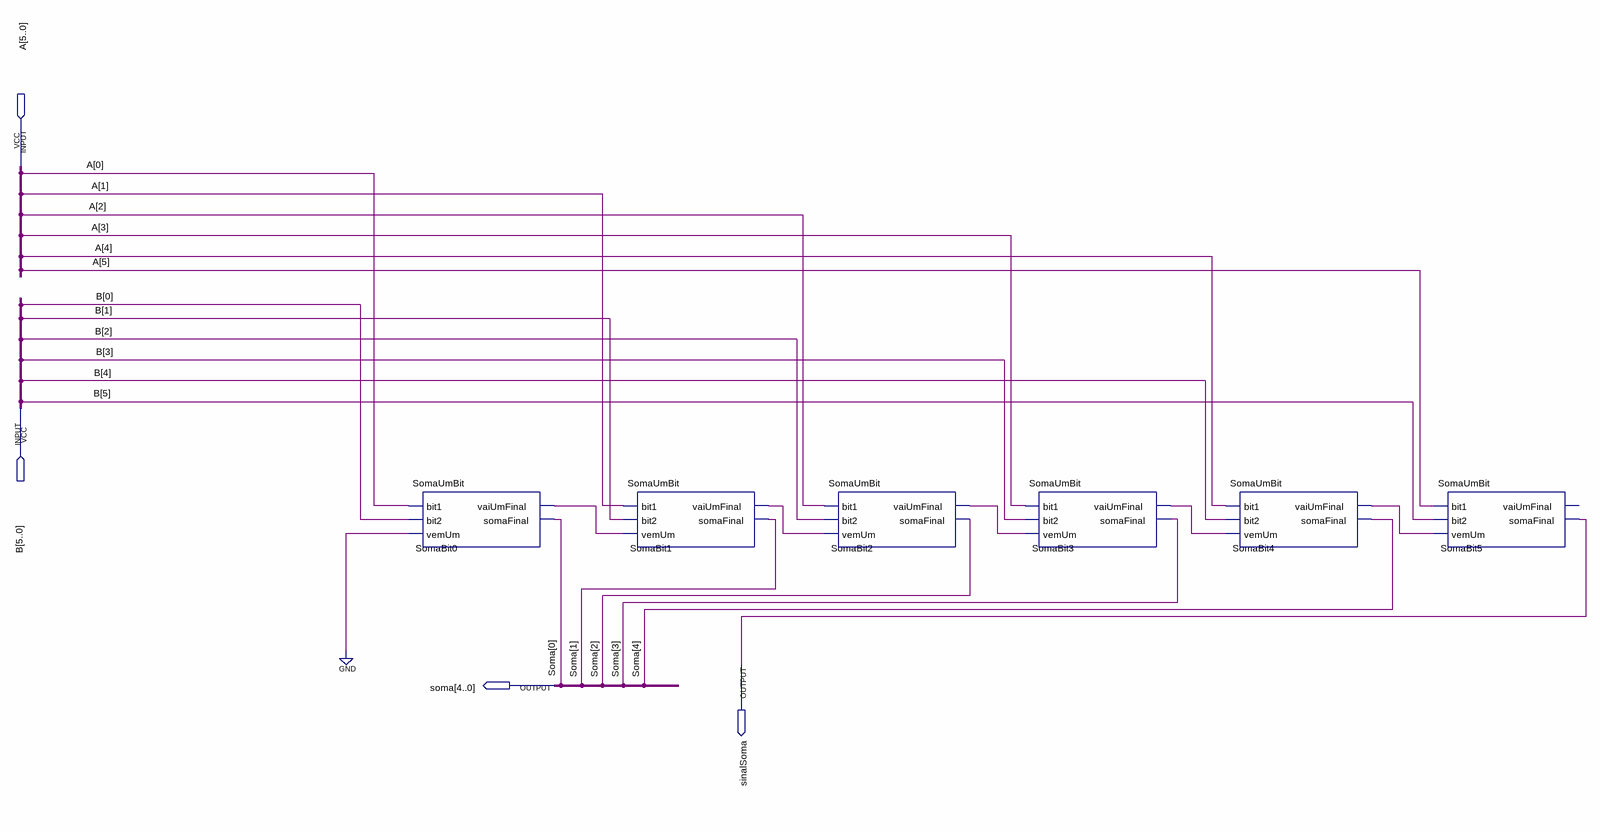
[diagram p0: schematic sheet]
// Quartus schematic SomaBitsComSinalComp.bdf as structural Verilog: 6 symbols, 4 pins
module SomaBitsComSinalComp (
  input  [5:0] A,
  input  [5:0] B,
  output sinalSoma,
  output [4:0] soma
);

  wire SomaBit0_vaiumfinal, SomaBit1_vaiumfinal, SomaBit2_vaiumfinal, SomaBit3_vaiumfinal,
       SomaBit4_vaiumfinal;

  SomaUmBit SomaBit0 (.bit1(A[0]), .bit2(B[0]), .vemUm(1'b0), .vaiUmFinal(SomaBit0_vaiumfinal), .somaFinal(soma[0]));
  SomaUmBit SomaBit1 (
    .bit1(A[1]), .bit2(B[1]), .vemUm(SomaBit0_vaiumfinal), .vaiUmFinal(SomaBit1_vaiumfinal),
    .somaFinal(soma[1]));
  SomaUmBit SomaBit2 (
    .bit1(A[2]), .bit2(B[2]), .vemUm(SomaBit1_vaiumfinal), .vaiUmFinal(SomaBit2_vaiumfinal),
    .somaFinal(soma[2]));
  SomaUmBit SomaBit3 (
    .bit1(A[3]), .bit2(B[3]), .vemUm(SomaBit2_vaiumfinal), .vaiUmFinal(SomaBit3_vaiumfinal),
    .somaFinal(soma[3]));
  SomaUmBit SomaBit4 (
    .bit1(A[4]), .bit2(B[4]), .vemUm(SomaBit3_vaiumfinal), .vaiUmFinal(SomaBit4_vaiumfinal),
    .somaFinal(soma[4]));
  SomaUmBit SomaBit5 (
    .bit1(A[5]), .bit2(B[5]), .vemUm(SomaBit4_vaiumfinal), .somaFinal(sinalSoma));  // open: vaiUmFinal
endmodule
